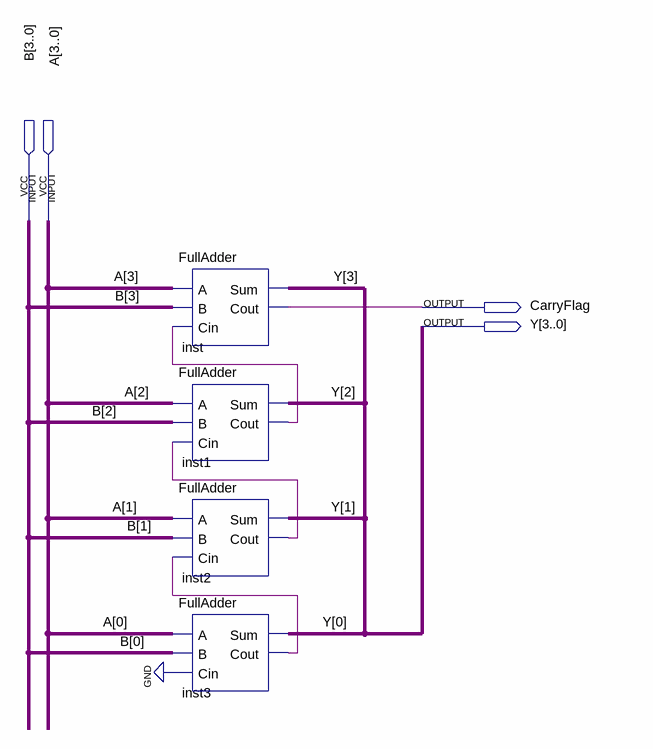
[diagram p0: schematic sheet]
// Quartus schematic FullAdder4bit.bdf as structural Verilog: 4 symbols, 4 pins
module FullAdder4bit (
  input  [3:0] B,
  input  [3:0] A,
  output CarryFlag,
  output [3:0] Y
);

  wire inst1_cout, inst2_cout, inst3_cout;

  FullAdder inst (.A(A[3]), .B(B[3]), .Cin(inst1_cout), .Sum(Y[3]), .Cout(CarryFlag));
  FullAdder inst1 (.A(A[2]), .B(B[2]), .Cin(inst2_cout), .Sum(Y[2]), .Cout(inst1_cout));
  FullAdder inst2 (.A(A[1]), .B(B[1]), .Cin(inst3_cout), .Sum(Y[1]), .Cout(inst2_cout));
  FullAdder inst3 (.A(A[0]), .B(B[0]), .Cin(1'b0), .Sum(Y[0]), .Cout(inst3_cout));
endmodule
